# Altium schematic sheet USBPD_Sink.SchDoc
size A3
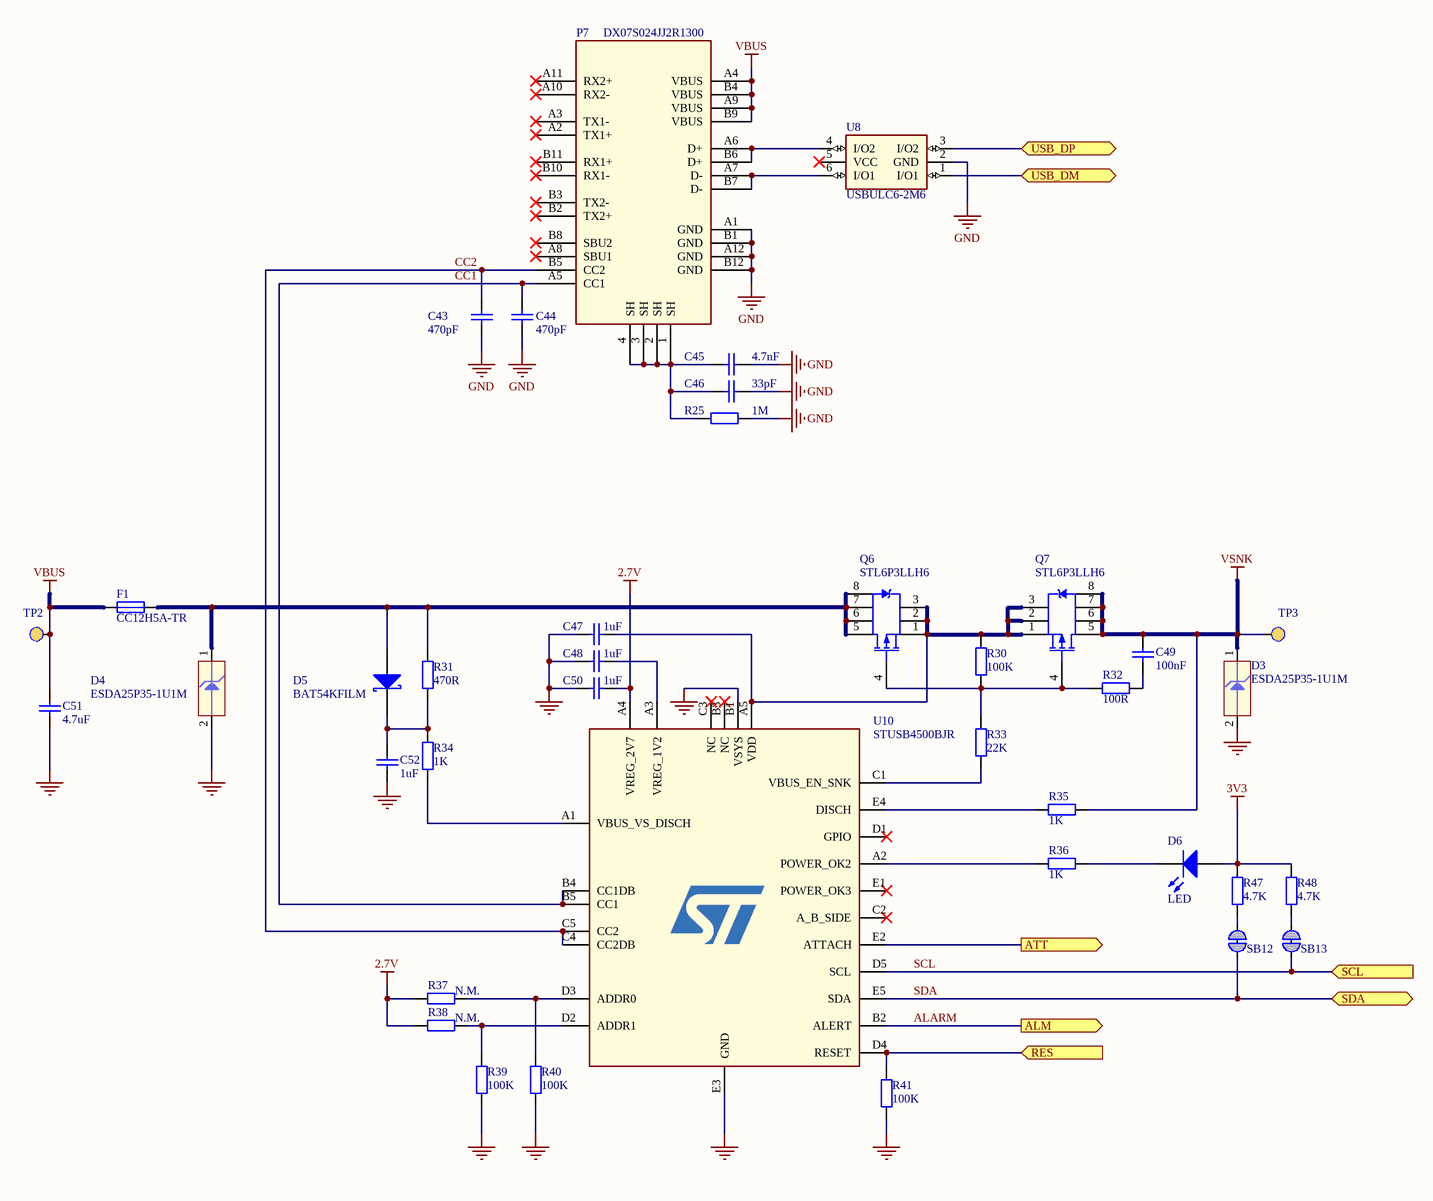
[diagram p0: USBPD_Sink.SchDoc]

## Parts
C43  value 470pF  [C0402]  (hidden comment: Cap Semi)
C44  value 470pF  [C0402]  (hidden comment: Cap Semi)
C45  value 4.7nF  [C0402]  (hidden comment: Cap Semi)
C46  value 33pF  [C0402]  (hidden comment: Cap Semi)
C47  value 1uF  [C0402]  (hidden comment: Cap Semi)
C48  value 1uF  [C0402]  (hidden comment: Cap Semi)
C49  value 100nF  [C0402]  (hidden comment: Cap Semi)
C50  value 1uF  [C0402]  (hidden comment: Cap Semi)
C51  value 4.7uF  [C0603]  (hidden comment: Cap Semi)
C52  value 1uF  [C0402]  (hidden comment: Cap Semi)
D3  ESDA25P35-1U1M  [QFN1610]
D4  ESDA25P35-1U1M  [QFN1610]
D5  BAT54KFILM  [SOD-523]
D6  LED  [PICOLED]
F1  CC12H5A-TR  [R1206]
P7  DX07S024JJ2R1300  [DX07_USB_C]
Q6  STL6P3LLH6  [PowerFLAT™ 3.3 x 3.3]
Q7  STL6P3LLH6  [PowerFLAT™ 3.3 x 3.3]
R25  value 1M  [R0402]  (hidden comment: Res2)
R30  value 100K  [R0402]  (hidden comment: Res2)
R31  value 470R  [R0402]  (hidden comment: Res2)
R32  value 100R  [R0402]  (hidden comment: Res2)
R33  value 22K  [R0402]  (hidden comment: Res2)
R34  value 1K  [R0402]  (hidden comment: Res2)
R35  value 1K  [R0402]  (hidden comment: Res2)
R36  value 1K  [R0402]  (hidden comment: Res2)
R37  value N.M.  [R0402]  (hidden comment: Res2)  (no BOM)
R38  value N.M.  [R0402]  (hidden comment: Res2)  (no BOM)
R39  value 100K  [R0402]  (hidden comment: Res2)
R40  value 100K  [R0402]  (hidden comment: Res2)
R41  value 100K  [R0402]  (hidden comment: Res2)
R47  value 4.7K  [R0402]  (hidden comment: Res2)
R48  value 4.7K  [R0402]  (hidden comment: Res2)
SB12  Solderbridge  [Solderbridge_Shorted]  (value not drawn)  (net tie, no BOM)
SB13  Solderbridge  [Solderbridge_Shorted]  (value not drawn)  (net tie, no BOM)
TP2  Test_Point  [TEST_POINT]  (value not drawn)  (no BOM)
TP3  Test_Point  [TEST_POINT]  (value not drawn)  (no BOM)
U8  USBULC6-2M6  [Micro_QFN_6L]
U10  STUSB4500BJR  [WLCSP 2.6x2.6x0.5]

## Ports
ALM (out), ATT (out), RES (in), SCL (in), SDA (bidir), USB_DM (bidir), USB_DP (bidir)

## Nets
2.7V: C50.1 R37.1 R38.1 U10.A4(VREG_2V7)
3V3: D6.1(A) R47.1 R48.1
GND: C43.1 C44.1 C45.1 C46.1 C47.2 C48.2 C50.2 C51.2 C52.2 D3.2(PIN2) D4.2(PIN2) P7.A1(GND) P7.A12(GND) P7.B1(GND) P7.B12(GND) R25.1 R39.2 R40.2 R41.2 U8.2(GND) U10.B1(VSYS) U10.E3(GND)
VBUS: C51.1 F1.2 P7.A4(VBUS) P7.A9(VBUS) P7.B4(VBUS) P7.B9(VBUS) TP2.0
VSNK: C49.2 D3.1(PIN1) Q7.5(D) Q7.6(D) Q7.7(D) Q7.8(D) R35.2 TP3.0
ALARM: U10.B2(ALERT) ; port ALM
ATT: U10.E2(ATTACH) ; port ATT
CC1: C44.2 P7.A5(CC1) U10.B4(CC1DB) U10.B5(CC1)
CC2: C43.2 P7.B5(CC2) U10.C4(CC2DB) U10.C5(CC2)
RES: R41.1 U10.D4(RESET) ; port RES
SCL: SB13.2 U10.D5(SCL) ; port SCL
SDA: SB12.2 U10.E5(SDA) ; port SDA
USB_DM: U8.1(I/O1) ; port USB_DM
USB_DP: U8.3(I/O2) ; port USB_DP
NetC45_2: C45.2 C46.2 P7.1(SH) P7.2(SH) P7.3(SH) P7.4(SH) R25.2
NetC47_1: C47.1 Q6.1(S) Q6.2(S) Q6.3(S) Q7.1(S) Q7.2(S) Q7.3(S) R30.1 U10.A5(VDD)
NetC48_1: C48.1 U10.A3(VREG_1V2)
NetC49_1: C49.1 R32.2
NetC52_1: C52.1 D5.2(K) R31.2 R34.1
NetD4_1: D4.1(PIN1) D5.1(A) F1.1 Q6.5(D) Q6.6(D) Q6.7(D) Q6.8(D) R31.1
NetD6_2: D6.2(K) R36.2
NetP7_A6: P7.A6(D+) P7.B6(D+) U8.4(I/O2)
NetP7_A7: P7.A7(D-) P7.B7(D-) U8.6(I/O1)
NetQ6_4: Q6.4(G) Q7.4(G) R30.2 R32.1 R33.1
NetR33_2: R33.2 U10.C1(VBUS_EN_SNK)
NetR34_2: R34.2 U10.A1(VBUS_VS_DISCH)
NetR35_1: R35.1 U10.E4(DISCH)
NetR36_1: R36.1 U10.A2(POWER_OK2)
NetR37_2: R37.2 R40.1 U10.D3(ADDR0)
NetR38_2: R38.2 R39.1 U10.D2(ADDR1)
NetR47_2: R47.2 SB12.1
NetR48_2: R48.2 SB13.1

Not connected (* = marked no-connect by the designer): P7 A2(TX1+)* A3(TX1-)* A8(SBU1)* A10(RX2-)* A11(RX2+)* B2(TX2+)* B3(TX2-)* B8(SBU2)* B10(RX1-)* B11(RX1+)*; U8 5(VCC)*; U10 B3(NC)* C2(A_B_SIDE)* C3(NC)* D1(GPIO)* E1(POWER_OK3)*

## Library data of the parts
C43 C44 = Cap Semi: Capacitor (Semiconductor SIM Model); Manufacturer: Samsung EM; Manufacturer Part No.: CL05C471JB5NNNC; Part Description: Ceramic Capacitor; Specification: NP0, 50V, 5%; Supplier: Rutronik; Supplier part number: KKK18704; Link: https://www.rutronik24.com/product/samsung+em/cl05c471jb5nnnc/30810.html
C45 = Cap Semi: Capacitor (Semiconductor SIM Model); Manufacturer: YAGEO; Manufacturer Part No.: CC0402KRX7R9BB472; Part Description: Ceramic Capacitor; Specification: X7R, 50V, 10%; Supplier: Rutronik; Supplier part number: KKK17246; Link: https://www.rutronik24.com/search-result/qs:KKK17246/reset:0
C46 = Cap Semi: Capacitor (Semiconductor SIM Model); Manufacturer: AVX; Manufacturer Part No.: 04025A330JAT2A; Part Description: Ceramic Capacitor; Specification: NP0, 50V, 5%; Supplier: Rutronik; Supplier part number: KKK13594; Link: https://www.rutronik24.com/product/avx/04025a330jat2a/3692730.html
C47 C48 C50 C52 = Cap Semi: Capacitor (Semiconductor SIM Model); Manufacturer: muRata; Manufacturer Part No.: GRM155R61E105KA12D; Part Description: Ceramic Capacitor; Specification: X5R, 25V, 10%; Supplier: Rutronik; Supplier part number: KKS4987; Link: https://www.rutronik24.com/product/murata/grm155r61e105ka12d/4725132.html
C49 = Cap Semi: Capacitor (Semiconductor SIM Model); Manufacturer: YAGEO; Manufacturer Part No.: CC0402KRX7R9BB104; Part Description: Ceramic Capacitor; Specification: X7R, 50V, 10%; Supplier: Rutronik; Supplier part number: KKK23619; Link: https://www.rutronik24.com/search-result/qs:KKK23619/reset:0
C51 = Cap Semi: Capacitor (Semiconductor SIM Model); Manufacturer: Samsung EM; Manufacturer Part No.: CL10A475KA8NQNC; Part Description: Ceramic Capacitor; Specification: X5R, 25V, 10%; Supplier: Rutronik; Supplier part number: KKS2862; Link: https://www.rutronik24.com/category-type/ceramic-chip-high-values/chip-cap-06031f/case-size:0603/cn:4%252C7%25C2%25B5/move:0/vn:25
D3 D4 = ESD_Diode: ESD Diode Symbol; Manufacturer: STMicroelectronics; Part Description: High power transient voltage suppressor; Specification: 22V, 1.4kW; Link: https://www.rutronik24.com/search-result/nojs:1337/qs:ESDA25P35-1U1M/reset:0; Manufacturer Part No.: ESDA25P35-1U1M; Supplier: Rutronik; Supplier part number: DTRL11228; Value: ESDA25P35-1U1M
D5 = D Schottky: Schottky Diode; Manufacturer: STMicroelectronics; Part Description: Small signal Schottky diode; Specification: 40V, 0.3A; Manufacturer Part No.: BAT54KFILM; Supplier: Rutronik; Supplier part number: DSKY5066; Value: BAT54KFILM; Link: https://www.rutronik24.com/search-result/nojs:1337/qs:BAT54KFILM/reset:0
D6 = LED2: Typical SMD LED; Manufacturer: OSRAM; Manufacturer Part No.: LTQH9G-Q2OO-25-2Z4Y-5-R18; Specification: Green, 5mA; Value: LTQH9G-Q2OO-25-2Z4Y-5-R18; Supplier: Rutronik; Supplier part number: LED22816; Part Description: Typical SMD LED; Link: https://www.rutronik24.com/product/osram/ltqh9g-q2oo-25-2z4y-5-r18/7461152.html
F1 = Fuse: Manufacturer: EATON; Part Description: High I²t Chip fuse; Specification: 32V, 5A; Link: https://www.rutronik24.com/search-result/nojs:1337/qs:CC12H5A-TR/reset:0; Manufacturer Part No.: CC12H5A-TR; Supplier: Rutronik; Supplier part number: FUSE7161; Value: CC12H5A-TR
P7 = DX07S024JJ2R1300: 24P USB C DUAL SMT ON BOARD; Manufacturer: JAE; Specification: Type C; Link: https://www.rutronik24.com/product/jae/dx07s024jj2r1300/8301548.html; Manufacturer Part No.: DX07S024JJ2R1300; Part Description: 24P USB C DUAL SMT ON BOARD; Supplier: Rutronik; Supplier part number: CONIO1808; Value: DX07S024JJ2R1300
Q6 Q7 = STL6P3LLH6: Power MOSFET; Manufacturer: STMicroelectronics; Part Description: P-channel Power MOSFET; Specification: 30V, 6A; Manufacturer Part No.: STL6P3LLH6; Supplier: Rutronik; Supplier part number: STL6P3LLH6; Value: STL6P3LLH6; Link: https://www.rutronik24.com/search-result/qs:STL6P3LLH6/reset:0
R25 = Res2: Manufacturer: ASJ; Manufacturer Part No.: CR10-105-JK; Part Description: Thick Film Resistor; Specification: 5% 0,063W; Supplier: Rutronik; Supplier part number: WRC35254; Link: https://www.rutronik24.com/product/asj/cr10-105-jk/51971.html
R30 R39-R41 = Res2: Manufacturer: ASJ; Manufacturer Part No.: CR10-104-JN; Part Description: Thick Film Resistor; Specification: 5% 0,063W; Supplier: Rutronik; Supplier part number: WRC57986; Link: https://www.rutronik24.com/product/asj/cr10-104-jn/9808104.html
R31 = Res2: Manufacturer: ASJ; Manufacturer Part No.: CR10-471-JK; Part Description: Thick Film Resistor; Specification: 5% 0,063W; Supplier: Rutronik; Supplier part number: WRC41425; Link: https://www.rutronik24.com/product/asj/cr10-471-jk/54391.html
R32 = Res2: Manufacturer: YAGEO; Manufacturer Part No.: RC0402JR-07100RL; Part Description: Thick Film Resistor; Specification: 5% 0,063W; Supplier: Rutronik; Supplier part number: WRC33811; Link: https://www.rutronik24.com/product/yageo/rc0402jr-07100rl/50982.html
R33 = Res2: Manufacturer: ASJ; Manufacturer Part No.: CR10-223-JK; Part Description: Thick Film Resistor; Specification: 5% 0,063W; Supplier: Rutronik; Supplier part number: WRC34603; Link: https://www.rutronik24.com/product/asj/cr10-223-jk/51597.html
R34-R36 = Res2: Manufacturer: ASJ; Manufacturer Part No.: CR10-102-JK; Part Description: Thick Film Resistor; Specification: 5% 0,063W; Supplier: Rutronik; Supplier part number: WRC41426; Link: https://www.rutronik24.com/search-result/qs:CR10-102-JK/reset:0
R37 R38 = Res2: Manufacturer: Yageo; Manufacturer Part No.: RC0402JR-0710KL; Part Description: Thick Film Resistor; Specification: 5% 0,063W; Supplier: Rutronik; Supplier part number: WRC33854; Link: https://www.rutronik24.com/search-result/nojs:1337/qs:RC0402JR-0710KL/reset:0
R47 R48 = Res2: Manufacturer: ASJ; Manufacturer Part No.: CR10-472-JK; Part Description: Thick Film Resistor; Specification: 5% 0,063W; Supplier: Rutronik; Supplier part number: WRC41427; Link: https://www.rutronik24.com/product/asj/cr10-472-jk/54393.html
SB12 SB13 = Solderbridge Shorted: Manufacturer: *; Value: Solderbridge; Supplier: *; Supplier part number: *
TP2 TP3 = Test_Point: Test Point
U8 = USBULC6-2M6: Ultra large bandwidth ESD protection; Manufacturer: STMicroelectronics; Specification: 6V, 0.6pF; Link: https://www.rutronik24.com/product/st/usbulc6-2m6/3623499.html; Manufacturer Part No.: USBULC6-2M6; Part Description: Ultra large bandwidth ESD protection; Supplier: Rutronik; Supplier part number: DTRL11259; Value: USBULC6-2M6
U10 = STUSB4500BJR: Standalone USB PD sink controller with short-to-VBUS protections; Manufacturer: STMicroelectronics; Part Description: Stand-alone USB PD controller; Rule: UNIONINDEX=0|RULEKIND=Clearance|NETSCOPE=DifferentNets|LAYERKIND=SameLayer|NAME=Schematic Clearance Constraint|GAP=3.937mil|GENERICCLEARANCE=3.937mil|IGNOREPADTOPADCLEARANCEINFOOTPRINT=FALSE|OBJECTCLEARANCES= |UNIT=Metric; Specification: 4.1V ~ 22V; Link: https://www.rutronik24.com/search-result/qs:STUSB4500BJR/reset:0; Manufacturer Part No.: STUSB4500BJR; Supplier: Rutronik; Supplier part number: STUSB4500BJR; Value: STUSB4500BJR